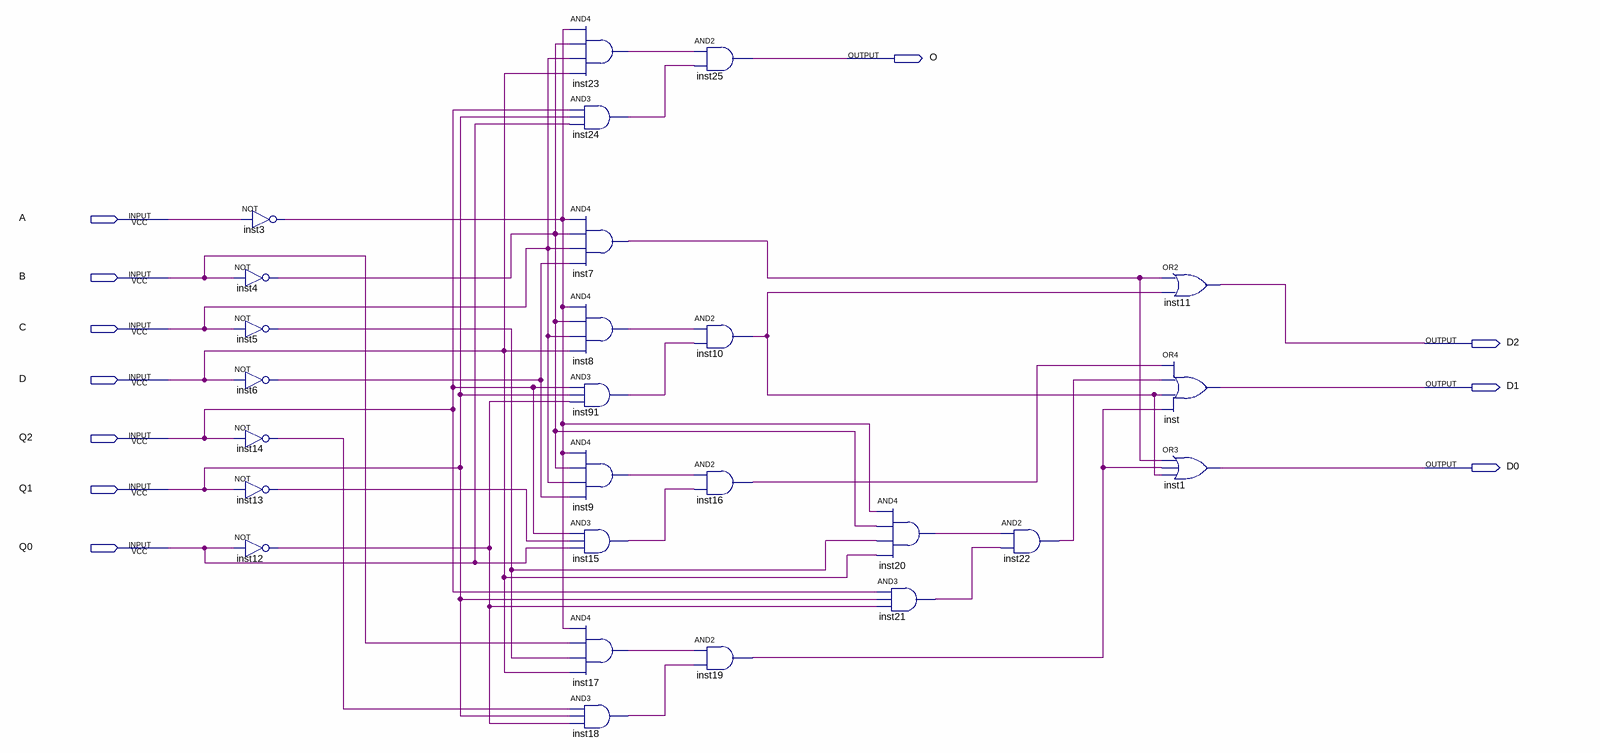
[diagram p0: schematic sheet]
// Quartus schematic IntegratedCircuit.bdf as structural Verilog: 26 symbols, 11 pins
module IntegratedCircuit (
  input  A,
  input  B,
  input  C,
  input  D,
  input  Q2,
  input  Q1,
  input  Q0,
  output O,
  output D2,
  output D1,
  output D0
);

  wire inst3_out, inst4_out, inst5_out, inst6_out, inst7_out, inst8_out, inst9_out, inst10_out, inst12_out,
       inst13_out, inst14_out, inst15_out, inst16_out, inst17_out, inst18_out, inst19_out, inst20_out,
       inst21_out, inst22_out, inst23_out, inst24_out, inst91_out;

  not inst3 (inst3_out, A);
  not inst4 (inst4_out, B);
  not inst5 (inst5_out, C);
  not inst6 (inst6_out, D);
  not inst14 (inst14_out, Q2);
  not inst13 (inst13_out, Q1);
  not inst12 (inst12_out, Q0);
  and inst23 (inst23_out, inst3_out, inst4_out, C, D);
  and inst24 (inst24_out, Q2, Q1, Q0);
  and inst7 (inst7_out, inst3_out, inst4_out, C, inst6_out);
  and inst8 (inst8_out, inst3_out, inst4_out, C, D);
  and inst91 (inst91_out, Q2, Q1, inst12_out);
  and inst9 (inst9_out, inst3_out, inst4_out, C, inst6_out);
  and inst15 (inst15_out, Q2, inst13_out, Q0);
  and inst17 (inst17_out, inst3_out, B, inst5_out, D);
  and inst18 (inst18_out, inst14_out, Q1, inst12_out);
  and inst25 (O, inst23_out, inst24_out);
  and inst10 (inst10_out, inst8_out, inst91_out);
  and inst16 (inst16_out, inst9_out, inst15_out);
  and inst19 (inst19_out, inst17_out, inst18_out);
  and inst20 (inst20_out, inst3_out, inst4_out, inst5_out, D);
  and inst21 (inst21_out, Q2, Q1, inst12_out);
  and inst22 (inst22_out, inst20_out, inst21_out);
  or inst11 (D2, inst7_out, inst10_out);
  or inst (D1, inst16_out, inst22_out, inst10_out, inst19_out);
  or inst1 (D0, inst7_out, inst19_out, inst10_out);
endmodule
